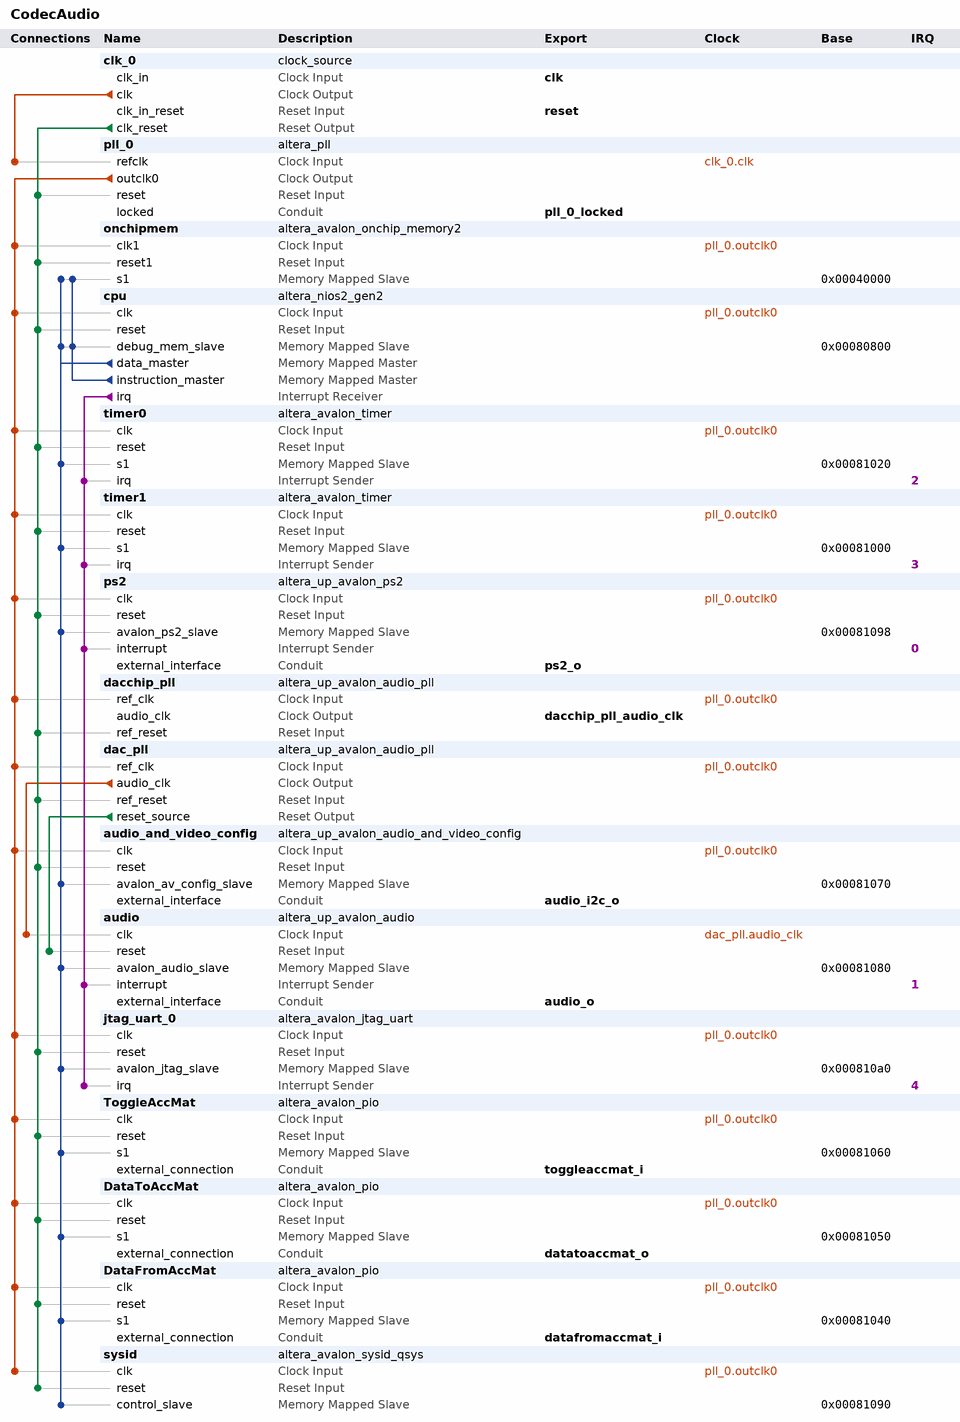
[diagram p0: system contents]
# Platform Designer (Qsys) system CodecAudio, Cyclone V 5CSEMA5F31C6
# Parameters at their usual value, and those the tool derives, are not listed.
package require -exact qsys 15.1
create_system CodecAudio
set_project_property DEVICE_FAMILY {Cyclone V}
set_project_property DEVICE 5CSEMA5F31C6

add_instance clk_0 clock_source 15.1
set_instance_parameter_value clk_0 clockFrequency 50000000

add_instance pll_0 altera_pll 15.1
set_instance_parameter_value pll_0 gui_device_speed_grade 1
set_instance_parameter_value pll_0 gui_number_of_clocks 1
set_instance_parameter_value pll_0 gui_operation_mode direct
set_instance_parameter_value pll_0 gui_output_clock_frequency0 100.0
set_instance_parameter_value pll_0 gui_pll_mode {Integer-N PLL}
set_instance_parameter_value pll_0 gui_reference_clock_frequency 50.0
set_instance_parameter_value pll_0 gui_use_locked true

add_instance onchipmem altera_avalon_onchip_memory2 15.1
set_instance_parameter_value onchipmem dataWidth 32
set_instance_parameter_value onchipmem dualPort false
set_instance_parameter_value onchipmem initMemContent true
set_instance_parameter_value onchipmem initializationFileName onchip_mem.hex
set_instance_parameter_value onchipmem memorySize 262144

add_instance cpu altera_nios2_gen2 15.1
set_instance_parameter_value cpu dcache_size 2048
set_instance_parameter_value cpu exceptionSlave onchipmem.s1
set_instance_parameter_value cpu icache_size 4096
set_instance_parameter_value cpu impl Tiny
set_instance_parameter_value cpu resetSlave onchipmem.s1

add_instance timer0 altera_avalon_timer 15.1
set_instance_parameter_value timer0 alwaysRun true
set_instance_parameter_value timer0 fixedPeriod true
set_instance_parameter_value timer0 period 2083
set_instance_parameter_value timer0 periodUnits USEC

add_instance timer1 altera_avalon_timer 15.1
set_instance_parameter_value timer1 period 1
set_instance_parameter_value timer1 periodUnits USEC

add_instance ps2 altera_up_avalon_ps2 15.1

add_instance dacchip_pll altera_up_avalon_audio_pll 15.1
set_instance_parameter_value dacchip_pll gui_refclk 50.0

add_instance dac_pll altera_up_avalon_audio_pll 15.1
set_instance_parameter_value dac_pll gui_refclk 50.0

add_instance audio_and_video_config altera_up_avalon_audio_and_video_config 15.1
set_instance_parameter_value audio_and_video_config audio_in {Microphone to ADC}
set_instance_parameter_value audio_and_video_config bit_length 24
set_instance_parameter_value audio_and_video_config board DE1-SoC
set_instance_parameter_value audio_and_video_config eai false
set_instance_parameter_value audio_and_video_config line_in_bypass false
set_instance_parameter_value audio_and_video_config sampling_rate {48 kHz}

add_instance audio altera_up_avalon_audio 15.1
set_instance_parameter_value audio audio_in false
set_instance_parameter_value audio avalon_bus_type {Memory Mapped}
set_instance_parameter_value audio dw 24

add_instance jtag_uart_0 altera_avalon_jtag_uart 15.1
set_instance_parameter_value jtag_uart_0 simInteractiveOptions NO_INTERACTIVE_WINDOWS

add_instance ToggleAccMat altera_avalon_pio 15.1
set_instance_parameter_value ToggleAccMat captureEdge true
set_instance_parameter_value ToggleAccMat direction Input
set_instance_parameter_value ToggleAccMat edgeType FALLING
set_instance_parameter_value ToggleAccMat width 1

add_instance DataToAccMat altera_avalon_pio 15.1
set_instance_parameter_value DataToAccMat direction Output
set_instance_parameter_value DataToAccMat width 20

add_instance DataFromAccMat altera_avalon_pio 15.1
set_instance_parameter_value DataFromAccMat direction Input
set_instance_parameter_value DataFromAccMat width 24

add_instance sysid altera_avalon_sysid_qsys 15.1
set_instance_parameter_value sysid id 1

# connections
add_connection clk_0.clk pll_0.refclk clock
add_connection dac_pll.audio_clk audio.clk clock
add_connection pll_0.outclk0 audio_and_video_config.clk clock
add_connection pll_0.outclk0 cpu.clk clock
add_connection pll_0.outclk0 dac_pll.ref_clk clock
add_connection pll_0.outclk0 dacchip_pll.ref_clk clock
add_connection pll_0.outclk0 DataFromAccMat.clk clock
add_connection pll_0.outclk0 DataToAccMat.clk clock
add_connection pll_0.outclk0 jtag_uart_0.clk clock
add_connection pll_0.outclk0 onchipmem.clk1 clock
add_connection pll_0.outclk0 ps2.clk clock
add_connection pll_0.outclk0 sysid.clk clock
add_connection pll_0.outclk0 timer0.clk clock
add_connection pll_0.outclk0 timer1.clk clock
add_connection pll_0.outclk0 ToggleAccMat.clk clock
add_connection clk_0.clk_reset audio_and_video_config.reset reset
add_connection clk_0.clk_reset cpu.reset reset
add_connection clk_0.clk_reset dac_pll.ref_reset reset
add_connection clk_0.clk_reset dacchip_pll.ref_reset reset
add_connection clk_0.clk_reset DataFromAccMat.reset reset
add_connection clk_0.clk_reset DataToAccMat.reset reset
add_connection clk_0.clk_reset jtag_uart_0.reset reset
add_connection clk_0.clk_reset onchipmem.reset1 reset
add_connection clk_0.clk_reset pll_0.reset reset
add_connection clk_0.clk_reset ps2.reset reset
add_connection clk_0.clk_reset sysid.reset reset
add_connection clk_0.clk_reset timer0.reset reset
add_connection clk_0.clk_reset timer1.reset reset
add_connection clk_0.clk_reset ToggleAccMat.reset reset
add_connection dac_pll.reset_source audio.reset reset
add_connection cpu.data_master audio.avalon_audio_slave avalon
set_connection_parameter_value cpu.data_master/audio.avalon_audio_slave baseAddress 0x00081080
add_connection cpu.data_master audio_and_video_config.avalon_av_config_slave avalon
set_connection_parameter_value cpu.data_master/audio_and_video_config.avalon_av_config_slave baseAddress 0x00081070
add_connection cpu.data_master cpu.debug_mem_slave avalon
set_connection_parameter_value cpu.data_master/cpu.debug_mem_slave baseAddress 0x00080800
add_connection cpu.data_master DataFromAccMat.s1 avalon
set_connection_parameter_value cpu.data_master/DataFromAccMat.s1 baseAddress 0x00081040
add_connection cpu.data_master DataToAccMat.s1 avalon
set_connection_parameter_value cpu.data_master/DataToAccMat.s1 baseAddress 0x00081050
add_connection cpu.data_master jtag_uart_0.avalon_jtag_slave avalon
set_connection_parameter_value cpu.data_master/jtag_uart_0.avalon_jtag_slave baseAddress 0x000810a0
add_connection cpu.data_master onchipmem.s1 avalon
set_connection_parameter_value cpu.data_master/onchipmem.s1 baseAddress 0x00040000
add_connection cpu.data_master ps2.avalon_ps2_slave avalon
set_connection_parameter_value cpu.data_master/ps2.avalon_ps2_slave baseAddress 0x00081098
add_connection cpu.data_master sysid.control_slave avalon
set_connection_parameter_value cpu.data_master/sysid.control_slave baseAddress 0x00081090
add_connection cpu.data_master timer0.s1 avalon
set_connection_parameter_value cpu.data_master/timer0.s1 baseAddress 0x00081020
add_connection cpu.data_master timer1.s1 avalon
set_connection_parameter_value cpu.data_master/timer1.s1 baseAddress 0x00081000
add_connection cpu.data_master ToggleAccMat.s1 avalon
set_connection_parameter_value cpu.data_master/ToggleAccMat.s1 baseAddress 0x00081060
add_connection cpu.instruction_master cpu.debug_mem_slave avalon
set_connection_parameter_value cpu.instruction_master/cpu.debug_mem_slave baseAddress 0x00080800
add_connection cpu.instruction_master onchipmem.s1 avalon
set_connection_parameter_value cpu.instruction_master/onchipmem.s1 baseAddress 0x00040000
add_connection cpu.irq audio.interrupt interrupt
set_connection_parameter_value cpu.irq/audio.interrupt irqNumber 1
add_connection cpu.irq jtag_uart_0.irq interrupt
set_connection_parameter_value cpu.irq/jtag_uart_0.irq irqNumber 4
add_connection cpu.irq ps2.interrupt interrupt
set_connection_parameter_value cpu.irq/ps2.interrupt irqNumber 0
add_connection cpu.irq timer0.irq interrupt
set_connection_parameter_value cpu.irq/timer0.irq irqNumber 2
add_connection cpu.irq timer1.irq interrupt
set_connection_parameter_value cpu.irq/timer1.irq irqNumber 3

# exported interfaces
add_interface audio_i2c_o conduit end
set_interface_property audio_i2c_o EXPORT_OF audio_and_video_config.external_interface
add_interface audio_o conduit end
set_interface_property audio_o EXPORT_OF audio.external_interface
add_interface clk clock sink
set_interface_property clk EXPORT_OF clk_0.clk_in
add_interface dacchip_pll_audio_clk clock source
set_interface_property dacchip_pll_audio_clk EXPORT_OF dacchip_pll.audio_clk
add_interface datafromaccmat_i conduit end
set_interface_property datafromaccmat_i EXPORT_OF DataFromAccMat.external_connection
add_interface datatoaccmat_o conduit end
set_interface_property datatoaccmat_o EXPORT_OF DataToAccMat.external_connection
add_interface pll_0_locked conduit end
set_interface_property pll_0_locked EXPORT_OF pll_0.locked
add_interface ps2_o conduit end
set_interface_property ps2_o EXPORT_OF ps2.external_interface
add_interface reset reset sink
set_interface_property reset EXPORT_OF clk_0.clk_in_reset
add_interface toggleaccmat_i conduit end
set_interface_property toggleaccmat_i EXPORT_OF ToggleAccMat.external_connection

set_interconnect_requirement {$system} qsys_mm.clockCrossingAdapter HANDSHAKE
set_interconnect_requirement {$system} qsys_mm.enableEccProtection FALSE
set_interconnect_requirement {$system} qsys_mm.insertDefaultSlave FALSE
set_interconnect_requirement {$system} qsys_mm.maxAdditionalLatency 1

save_system CodecAudio.qsys
